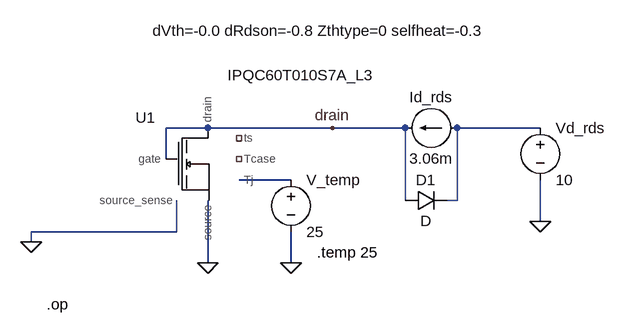
[diagram p0: schematic Si_MOSFET_Vth.asc]
Si_MOSFET_Vth.asc, the LTspice schematic file:
Version 4.1
SHEET 1 888 1272
WIRE 192 112 128 112
WIRE 384 112 192 112
WIRE 496 112 384 112
WIRE 704 112 576 112
WIRE 128 160 128 112
WIRE 320 192 240 192
WIRE 496 224 496 112
WIRE 576 224 576 112
WIRE 576 224 560 224
WIRE 704 256 704 192
WIRE 144 272 144 224
WIRE 144 272 -80 272
WIRE -80 288 -80 272
WIRE 192 320 192 224
WIRE 320 320 320 272
FLAG -80 288 0
FLAG 192 320 0
FLAG 320 320 0
FLAG 704 256 0
FLAG 384 112 drain
SYMBOL IPQC60T010S7_L3 192 176 R0
WINDOW 3 144 -161 Top 2
WINDOW 39 173 -229 Top 2
SYMATTR SpiceLine dVth=-0.0 dRdson=-0.8 Zthtype=0 selfheat=-0.3
SYMATTR InstName U1
SYMBOL voltage 320 176 R0
WINDOW 123 0 0 Left 0
WINDOW 39 0 0 Left 0
SYMATTR InstName V_temp
SYMATTR Value 25
SYMBOL current 576 112 R90
WINDOW 0 -32 40 VBottom 2
WINDOW 3 32 40 VTop 2
WINDOW 123 0 0 Left 0
WINDOW 39 0 0 Left 0
SYMATTR InstName Id_rds
SYMATTR Value 3.06m
SYMBOL diode 496 240 R270
WINDOW 0 32 32 VTop 2
WINDOW 3 0 32 VBottom 2
SYMATTR InstName D1
SYMBOL voltage 704 96 R0
SYMATTR InstName Vd_rds
SYMATTR Value 10
TEXT 360 304 Left 2 !.temp 25
TEXT -56 384 Left 2 !.op

The netlist it stands for:
* Si_MOSFET_Vth.asc
X§U1 drain drain 0 0 NC_01 N002 NC_02 IPQC60T010S7A_L3 dVth=-0.0 dRdson=-0.8 Zthtype=0 selfheat=-0.3  ; pins drain gate source source_sense ts Tj Tcase
V_temp N002 0 25
Id_rds N001 drain 3.06m
D1 drain N001 D
Vd_rds N001 0 10
.model D D
.lib standard.dio
.temp 25
.op
.lib IFX_S7A_TS_600V.lib
.backanno
.end